# Altium schematic sheet Opamp.SchDoc
size A4; Organization: Altium Limited; Address1: L3, 12a Rodborough Rd; Address2: Frenchs Forest; Address3: NSW; Address4: Australia 2086
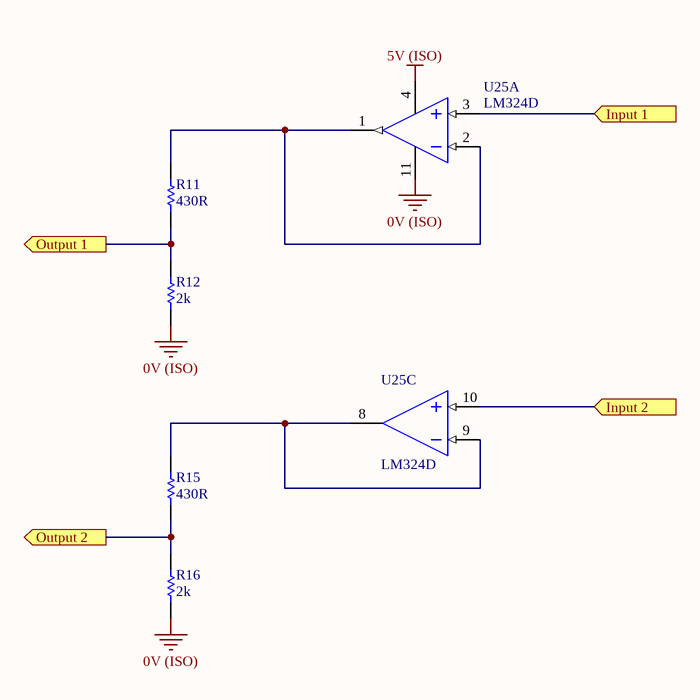
[diagram p0: Opamp.SchDoc]

## Parts
R11  430R  [0805]
R12  2k  [0805]
R15  430R  [0805]
R16  2k  [0805]
U25  LM324D  [TI 14-SOIC]  (parts A,C of 4)

## Ports
Input 1 (in), Input 2 (in), Output 1 (out), Output 2 (out)

## Nets
0V (ISO): R12.1 R16.1 U25.11(GND)
5V (ISO): U25.4(VCC)
Input 1: U25.3(1IN+) ; port Input 1
Input 2: U25.10(3IN+) ; port Input 2
Output 1: R11.1 R12.2 ; port Output 1
Output 2: R15.1 R16.2 ; port Output 2
NetR11_2: R11.2 U25.1(1OUT) U25.2(1IN+)
NetR15_2: R15.2 U25.8(3OUT) U25.9(3IN-)

## Notes on the sheet
- Title
- Size:
- Date:
- A4
- Number:
- Time:
- Revision:
- Sheet
- of
- File:

## Library data of the parts
R11 R15 = RC0805FR07430RL: Manufacturer: YAGEO; Tolerance: 0.01; Rated Voltage: 0.125W; Part Number: RC0805FR07430RL; Value: 430R; Material: FR-07; qty: 50
R12 R16 = RC0805FR072KL: Manufacturer: YAGEO; Tolerance: 0.01; Rated Voltage: 0.125W; Part Number: RC0805FR072KL; Value: 2k; Material: FR-07; qty: 50
U25 = LM324D: IC OPAMP GP 4 CIRCUIT 14SOIC; Manufacturer: Texas Instruments; Part Number: LM324D; Digikey Part Number: 296-1390-5-ND; Digikey Link: https://www.digikey.com/product-detail/en/texas-instruments/LM324D/296-1390-5-ND/277039